# Altium schematic sheet Control.SchDoc
size A; SheetNumber: 4; SheetTotal: 6
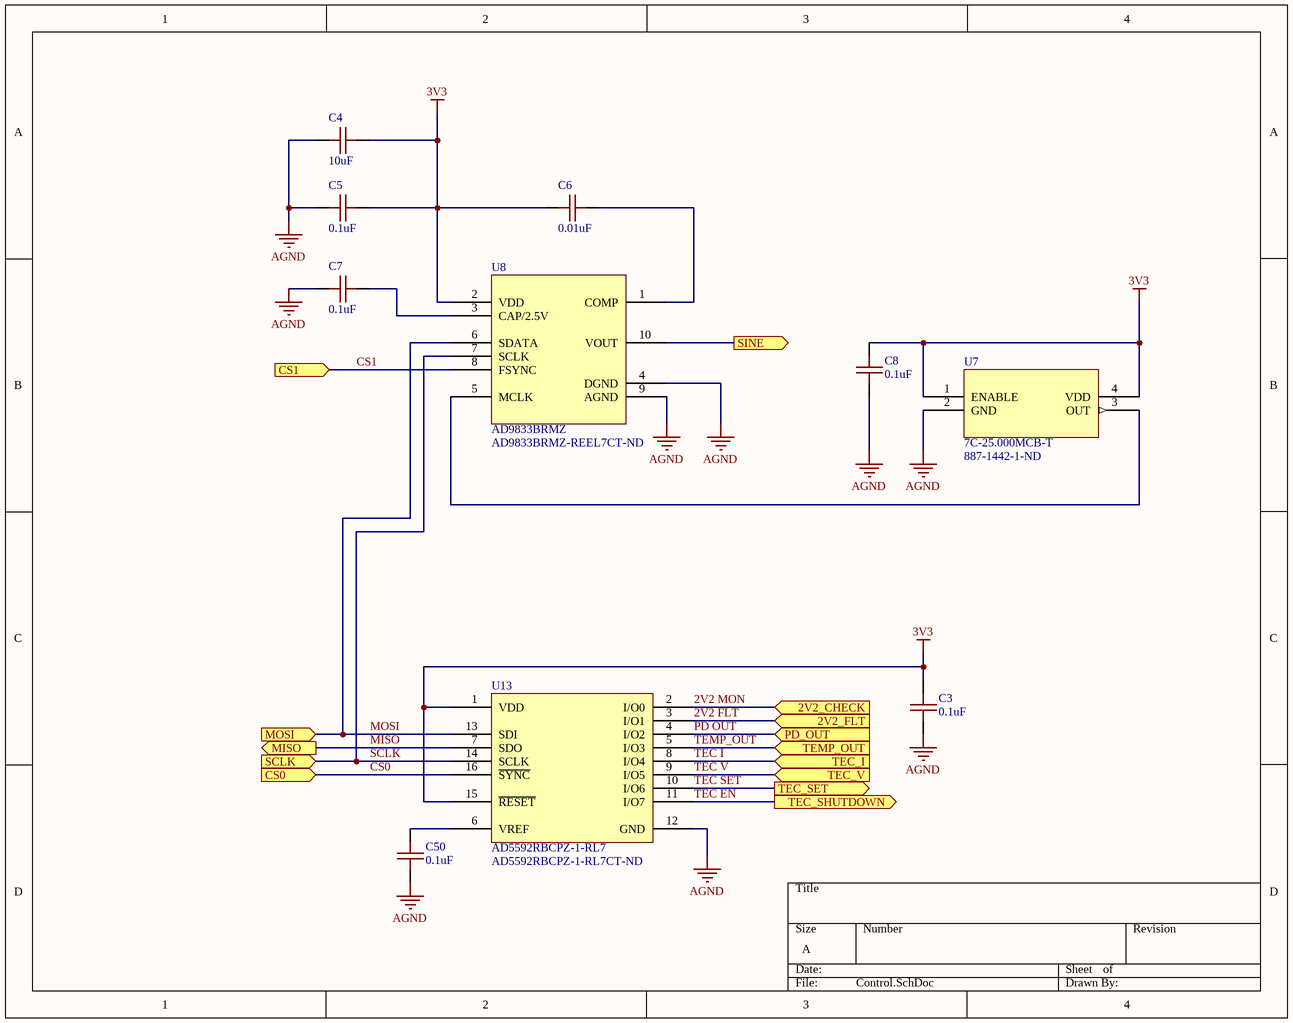
[diagram p0: Control.SchDoc]

## Parts
C3  0.1uF  [0603 B]
C4  10uF  [0603 B]
C5  0.1uF  [0603 B]
C6  0.01uF  [0603 B]
C7  0.1uF  [0603 B]
C8  0.1uF  [0603 B]
C50  0.1uF  [0603 B]
U7  7C-25.000MCB-T  Supplier Part Number 1: 887-1442-1-ND  [OSC_TXC_7C_TXC]
U8  AD9833BRMZ  Supplier Part Number 1: AD9833BRMZ-REEL7CT-ND  [RM_10_ADI]
U13  AD5592RBCPZ-1-RL7  Supplier Part Number 1: AD5592RBCPZ-1-RL7CT-ND  [LFCSP CP 16 2]

## Ports
2V2_CHECK (in), 2V2_FLT (in), CS0 (in), CS1 (in), MISO (out), MOSI (in), PD_OUT (in), SCLK (in), SINE (out), TEC_I (in), TEC_SET (out), TEC_SHUTDOWN (out), TEC_V (in), TEMP_OUT (in)

## Nets
3V3: C3.1 C4.2 C5.2 C6.1 C8.2 U7.1(ENABLE) U7.4(VDD) U8.2(VDD) U13.1(VDD) U13.15(~{RESET})
AGND: C3.2 C4.1 C5.1 C7.1 C8.1 C50.1 U7.2(GND) U8.4(DGND) U8.9(AGND) U13.12(GND)
2V2 FLT: U13.3(I/O1) ; port 2V2_FLT
2V2 MON: U13.2(I/O0) ; port 2V2_CHECK
CS0: U13.16(~{SYNC}) ; port CS0
CS1: U8.8(FSYNC) ; port CS1
MISO: U13.7(SDO) ; port MISO
MOSI: U8.6(SDATA) U13.13(SDI) ; port MOSI
PD OUT: U13.4(I/O2) ; port PD_OUT
SCLK: U8.7(SCLK) U13.14(SCLK) ; port SCLK
SINE: U8.10(VOUT) ; port SINE
TEC EN: U13.11(I/O7) ; port TEC_SHUTDOWN
TEC I: U13.8(I/O4) ; port TEC_I
TEC SET: U13.10(I/O6) ; port TEC_SET
TEC V: U13.9(I/O5) ; port TEC_V
TEMP_OUT: U13.5(I/O3) ; port TEMP_OUT
NetC6_2: C6.2 U8.1(COMP)
NetC7_2: C7.2 U8.3(CAP/2.5V)
NetC50_2: C50.2 U13.6(VREF)
NetU7_3: U7.3(OUT) U8.5(MCLK)

## Library data of the parts
C3-C8 C50 = CAP 0603: 603 Capacitor
  C3 C5 C7 C8 C50: Value: 0.1uF
  C4: Value: 10uF
  C6: Value: 0.01uF
U7 = 7C-25.000MCB-T: 25 MHz XO (Standard) CMOS Oscillator 2.5V Enable/Disable 4-SMD, No Lead; Vendor: TXC; Built_By: EMA_UL_Team; SourceLibrary: TXC_2011-01-01_OSC_7C; Manufacturer_Part_Number: 7C-25.000MCB-T; Copyright: Copyright (C) 2021 Accelerated Designs. All rights reserved; RefDes: RefDes; Type: DEV; ComponentLink1Description: New link; ComponentLink1URL: *; Supplier 1: Digi-Key
U8 = AD9833BRMZ: Low Power, 12.65 mW, 2.3 V to 5.5 V, Programmable Waveform Generator; Vendor: Analog Devices Inc; SourceLibrary: Analog_2015-12-15; Built_By: EMA_UL_Team; Manufacturer_Part_Number: AD9833BRMZ; Copyright: Copyright (C) 2018 Accelerated Designs. All rights reserved; RefDes: RefDes; Type: DEV; Supplier 1: Digi-Key
U13 = AD5592RBCPZ-1-RL7: 8-Channel, 12-Bit, Configurable ADC/DAC with On-Chip Reference, SPI Interface, LFCSP; SourceLibrary: Analog_2015-12-15; Built_By: EMA_UL_Team; Vendor: Analog Devices Inc; Manufacturer_Part_Number: AD5592RBCPZ-1-RL7; Copyright: Copyright (C) 2021 Accelerated Designs. All rights reserved; RefDes: RefDes; Type: DEV; Supplier 1: Digi-Key